# Altium schematic sheet StepUp_MT3608.SchDoc
size A4; SheetNumber: 2; SheetTotal: 7
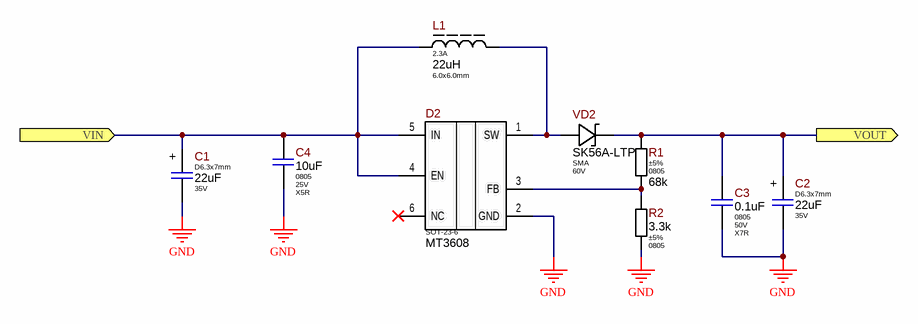
[diagram p0: StepUp_MT3608.SchDoc]

## Parts
C1  value 22uF  Package: D6.3x7mm  Voltage: 35V  [CAP-AE-PTH-63D05x70H10]  (hidden comment: 22uFx35V)
C2  value 22uF  Package: D6.3x7mm  Voltage: 35V  [CAP-AE-PTH-63D05x70H10]  (hidden comment: 22uFx35V)
C3  Package: 0805  Voltage: 50V  Dielectric Type: X7R  [CAP-0805(2012)X85T10]  (hidden comment: 0.1uF)
C4  Package: 0805  Voltage: 25V  Dielectric Type: X5R  [CAP-0805(2012)X125T20]  (hidden comment: 10uF)
D2  Package: SOT-23-6  [MT3608_MED]  (hidden comment: MT3608)
L1  Current: 2.3A  Package: 6.0x6.0mm  [SRN6045TA-SERIES]  (hidden comment: 22uH)
R1  Tolerance: ±5%  Package: 0805  [R_ANY_CHIP_0805_MED]  (hidden comment: 68k)
R2  Tolerance: ±5%  Package: 0805  [R_ANY_CHIP_0805_MED]  (hidden comment: 3.3k)
VD2  Package: SMA  Voltage: 60V  [SMA_MED]  (hidden comment: SK56A-LTP)

## Ports
VIN (in), VOUT (out)

## Nets
GND: C1.2 C2.2 C3.2 C4.2 D2.2(GND) R2.2
VIN: C1.1 C4.1 D2.4(EN) D2.5(IN) L1.1 ; port VIN
VOUT: C2.1 C3.1 R1.1 VD2.CA ; port VOUT
NetD2_1: D2.1(SW) L1.2 VD2.AN
NetD2_3: D2.3(FB) R1.2 R2.1

Not connected (* = marked no-connect by the designer): D2 6(NC)*

## Notes on the sheet
- (in symbol KZL-035V220ME070-T/R) +

## Library data of the parts
C1 C2 = KZL-035V220ME070-T/R: 22uF 35V ±20% D6.3x7mm Low Leakage Aluminum Electrolytic Capacitor; Manufacturer: Koshin; Ajax_1C_PN: NONE; Ajax_1С_Status: RND Only; Component Status: Released; Part Number: KZL-035V220ME070-T/R; Part Type: Aluminum; Component Type: PTH; Standard Lead Time: NONE; Temperature Range: -40°C ~ 105°C; Tolerance: ±20%; Dielectric Type: NONE; ComponentLink1URL: http://koshin.com.hk/upload/pdf/koshin/KZL.pdf; Replacement: NONE; Price: NONE; ComponentLink1Description: Datasheet
C3 = CL21B104KBCNNNC: 100nF 50V X7R ±10% 0805 Ceramic Capacitor RoHS; Manufacturer: Samsung Electro-Mechanics; Ajax_1C_ID: 1251; Ajax_1C_PN: 100nF 50V X7R 10% 0805 CL21B104KBCNNNC Ceramic Capacitor SMD RoHS; Ajax_1С_Status: Mass Production; Standard Lead Time: 22 Weeks; Component Status: Released; Replacement: NONE; GUID_1C: 2c368b99-dd41-11e0-af93-6c626deda1bb; Value: 0.1uF; Part Number: CL21B104KBCNNNC; Part Type: Ceramic / X7R / 0805; Component Type: SMD; Temperature Range: -55°C ~ 125°C; Tolerance: ±10%; ComponentLink1URL: https://media.digikey.com/pdf/Data%20Sheets/Samsung%20PDFs/CL_Series_MLCC_ds.pdf; Supplier 1: Digi-Key; Supplier Part Number 1: 1276-1003-2-ND; Price: 0,00700031; ComponentLink1Description: Datasheet
C4 = CL21A106KAYNNNG: 10uF 25V X5R ±20% 0805 Ceramic Capacitor RoHS; Manufacturer: Samsung Electro-Mechanics; Ajax_1C_ID: 21145; Ajax_1C_PN: 10uF 25V X5R 10% 0805 CL21A106KAYNNNG Ceramic Capacitor SMD RoHS; Ajax_1С_Status: Substitution; Standard Lead Time: 28 Weeks; Component Status: Released; Tolerance: ±10%; Replacement: NONE; GUID_1C: 339426c1-c281-11ea-ab62-0050569f2651; Value: 10uF; Part Number: CL21A106KAYNNNG; Part Type: Ceramic / X5R / 0805; Component Type: SMD; Temperature Range: -55°C ~ 85°C; ComponentLink1URL: https://media.digikey.com/pdf/Data%20Sheets/Samsung%20PDFs/CL_Series_MLCC_ds.pdf; Supplier 1: Digi-Key; Supplier Part Number 1: 1276-6454-2-ND; Price: 0,048; ComponentLink1Description: Datasheet
D2 = MT3608: 2V-24V Input High Efficiency 1.2MHz 2A Step Up Converter; Manufacturer: Aerosemi; Ajax_1C_ID: 8101; Ajax_1C_PN: MT3608 Aerosemi 2A Step Up Converter IC SOT-23-6; Ajax_1С_Status: Mass Production; Standard Lead Time: NONE; Component Status: Released; GUID_1C: 8b925ac5-fc04-11e5-817b-d8cb8a9acc66; Part Number: MT3608; Lifecycle: Not Recommended; Part Type: Power / DC-DC / Boost; Component Type: SMD; Temperature Range: -40°C ~ 85°C; ComponentLink1URL: https://www.olimex.com/Products/Breadboarding/BB-PWR-3608/resources/MT3608.pdf; Replacement: NONE; Price: 0,12; ComponentLink1Description: Datasheet
L1 = SRN6045TA-220M: 22uH Semi-Shielded Wirewound Inductor 2.3A 96mOhm; Manufacturer: Bourns Inc; Ajax_1C_ID: 17809; Ajax_1C_PN: 22uH 20% 2.3A SRN6045TA-220M SMD inductor; Ajax_1С_Status: Mass Production; Saturation Current: 3.3A; Tolerance: ±20%; Component Status: Released; Standard Lead Time: 20 Weeks; Replacement: NONE; GUID_1C: cd42fec6-0494-11ea-ab58-0050569f2651; Value: 22uH; Part Number: SRN6045TA-220M; Part Type: Power / Ferrite Core; Component Type: SMD; Temperature Range: -55°C ~ 125°C; ComponentLink1URL: https://www.bourns.com/docs/Product-Datasheets/SRN6045TA.pdf; Supplier 1: Digi-Key; Supplier Part Number 1: SRN6045TA-220MTR-ND; Price: 0,185; ComponentLink1Description: Datasheet
R1 = RC0805JR-072K2L: 2.2 kOhms ±5% 1/8W 0805 Thick Film Resistor; Manufacturer: Yageo; Ajax_1C_ID: 26119; Ajax_1C_PN: 2.2k 5% 0805 Resistors SMD RoHS; Ajax_1С_Status: RND Only; Power Rating: 0.125W; Voltage: 150V; Component Status: Released; Temperature Stability: ±100ppm/°C; Replacement: NONE; GUID_1C: 80325ec8-617a-11eb-ab6f-0050569f2651; Value: 68k; Part Number: RC0805JR-072K2L; Component Type: SMD; Part Type: Thick Film; Temperature Range: -55°C ~ 155°C; ComponentLink1URL: https://eu.mouser.com/datasheet/2/447/PYu_RC_Group_51_RoHS_L_11-1984063.pdf; Supplier 1: Digi-Key; Supplier Part Number 1: 311-2.2KARTR-ND; Price: 0,005; ComponentLink1Description: Datasheet
R2 = RC0805JR-073K3L: 3.3 kOhms ±5%, 1/8W 0805 Thick Film Resistor; Manufacturer: Yageo; Ajax_1C_ID: 9030; Ajax_1C_PN: 3.3k 5% 0805 Resistors SMD RoHS; Ajax_1С_Status: RND Only; Power Rating: 0.125W; Voltage: 150V; Component Status: Released; Temperature Stability: ±100ppm/°C; Replacement: NONE; GUID_1C: cb9785ec-9b47-11e6-8242-d8cb8a9acc66; Value: 3.3k; Part Number: RC0805JR-073K3L; Component Type: SMD; Part Type: Thick Film; Temperature Range: -55°C ~ 155°C; ComponentLink1URL: https://eu.mouser.com/datasheet/2/447/PYu_RC_Group_51_RoHS_L_10-1664068.pdf; Price: 0,001081; ComponentLink1Description: Datasheet
VD2 = SK56A-LTP: Diode Schottky 60V 5A, SMA; Manufacturer: Micro Commercial Components; Ajax_1C_ID: 12747; Ajax_1C_PN: SK56A-LTP диод; Ajax_1С_Status: Mass Production; Marking: SK56A; Component Status: Released; Standard Lead Time: 12 Weeks; Vf: 750mV @ 5A; Replacement: NONE; GUID_1C: b92aa543-5aa4-11e8-ab3c-0050569f2651; Part Number: SK56A-LTP; Part Type: Schottky; Component Type: SMD; Current: 5A; Temperature Range: -55°C ~ 150°C; ComponentLink1URL: https://www.mccsemi.com/pdf/Products/SK52A-L-SK510A-L(DO-214AC).pdf; Supplier 1: Digi-Key; Supplier Part Number 1: SK56A-LTPMSTR-ND; Price: 0,06; ComponentLink1Description: Datasheet